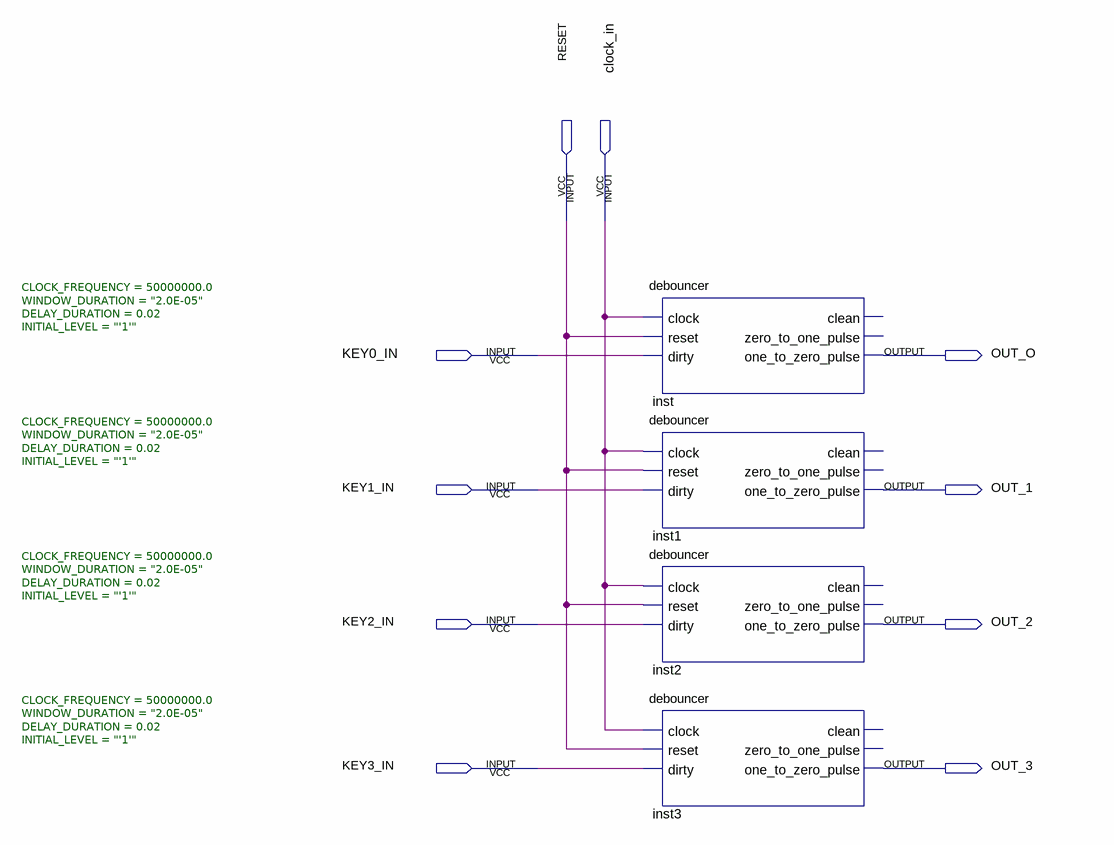
[diagram p0: schematic sheet]
// Quartus schematic INPUTS.bdf as structural Verilog: 4 symbols, 10 pins
module INPUTS (
  input  RESET,
  input  clock_in,
  input  KEY0_IN,
  input  KEY1_IN,
  input  KEY2_IN,
  input  KEY3_IN,
  output OUT_O,
  output OUT_1,
  output OUT_2,
  output OUT_3
);

  debouncer #(.CLOCK_FREQUENCY(50000000.0), .WINDOW_DURATION("2.0E-05"), .DELAY_DURATION(0.02), .INITIAL_LEVEL("'1'")) inst (
    .clock(clock_in), .reset(RESET), .dirty(KEY0_IN), .one_to_zero_pulse(OUT_O));  // open: clean, zero_to_one_pulse
  debouncer #(.CLOCK_FREQUENCY(50000000.0), .WINDOW_DURATION("2.0E-05"), .DELAY_DURATION(0.02), .INITIAL_LEVEL("'1'")) inst1 (
    .clock(clock_in), .reset(RESET), .dirty(KEY1_IN), .one_to_zero_pulse(OUT_1));  // open: clean, zero_to_one_pulse
  debouncer #(.CLOCK_FREQUENCY(50000000.0), .WINDOW_DURATION("2.0E-05"), .DELAY_DURATION(0.02), .INITIAL_LEVEL("'1'")) inst2 (
    .clock(clock_in), .reset(RESET), .dirty(KEY2_IN), .one_to_zero_pulse(OUT_2));  // open: clean, zero_to_one_pulse
  debouncer #(.CLOCK_FREQUENCY(50000000.0), .WINDOW_DURATION("2.0E-05"), .DELAY_DURATION(0.02), .INITIAL_LEVEL("'1'")) inst3 (
    .clock(clock_in), .reset(RESET), .dirty(KEY3_IN), .one_to_zero_pulse(OUT_3));  // open: clean, zero_to_one_pulse
endmodule
